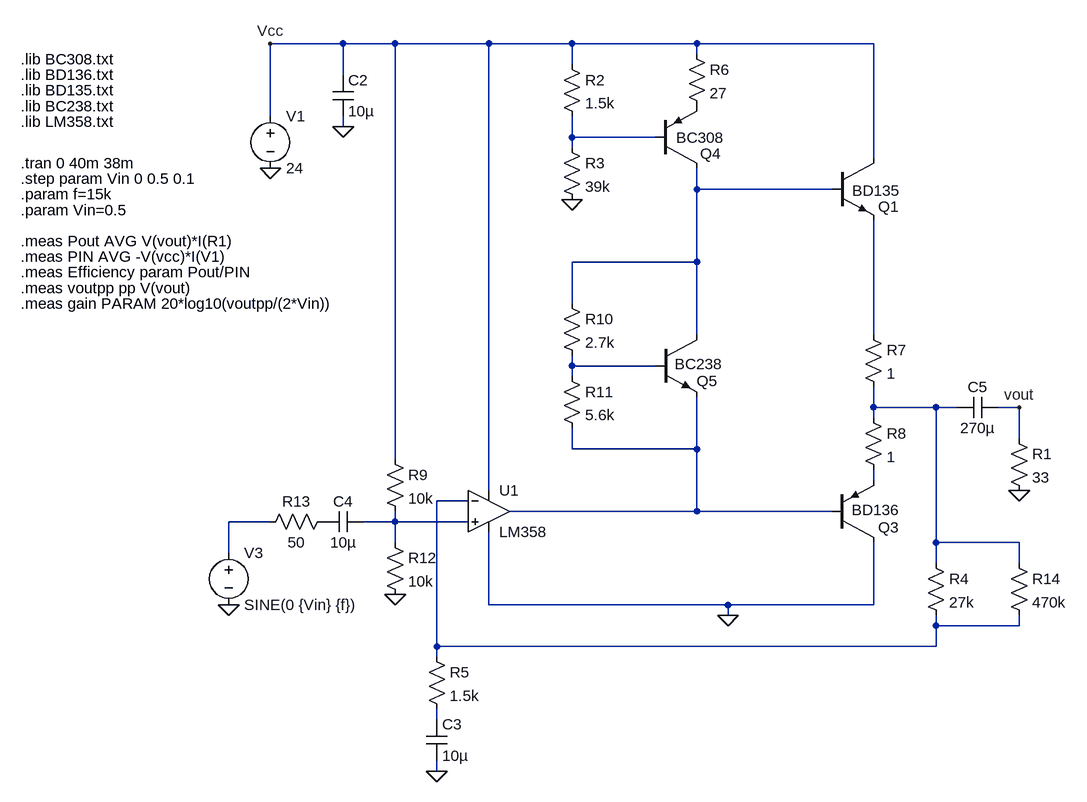
[diagram p0: schematic Draft1.asc]
Draft1.asc, the LTspice schematic file:
Version 4
SHEET 1 1868 680
WIRE 192 -672 80 -672
WIRE 272 -672 192 -672
WIRE 416 -672 272 -672
WIRE 544 -672 416 -672
WIRE 736 -672 544 -672
WIRE 1008 -672 736 -672
WIRE 736 -656 736 -672
WIRE 544 -640 544 -672
WIRE 192 -624 192 -672
WIRE 80 -560 80 -672
WIRE 192 -544 192 -560
WIRE 544 -528 544 -560
WIRE 672 -528 544 -528
WIRE 544 -512 544 -528
WIRE 1008 -496 1008 -672
WIRE 736 -448 736 -480
WIRE 944 -448 736 -448
WIRE 736 -336 736 -448
WIRE 736 -336 544 -336
WIRE 544 -272 544 -336
WIRE 736 -224 736 -336
WIRE 1008 -224 1008 -400
WIRE 544 -176 544 -192
WIRE 672 -176 544 -176
WIRE 544 -160 544 -176
WIRE 1008 -112 1008 -144
WIRE 1104 -112 1008 -112
WIRE 1136 -112 1104 -112
WIRE 1232 -112 1200 -112
WIRE 1008 -96 1008 -112
WIRE 1232 -64 1232 -112
WIRE 544 -48 544 -80
WIRE 736 -48 736 -128
WIRE 736 -48 544 -48
WIRE 272 -32 272 -672
WIRE 1008 0 1008 -16
WIRE 416 16 416 -672
WIRE 384 32 336 32
WIRE 736 48 736 -48
WIRE 736 48 448 48
WIRE 944 48 736 48
WIRE 80 64 16 64
WIRE 272 64 272 48
WIRE 272 64 224 64
WIRE 384 64 272 64
WIRE 272 96 272 64
WIRE 1104 96 1104 -112
WIRE 1232 96 1104 96
WIRE 16 112 16 64
WIRE 1104 128 1104 96
WIRE 1232 128 1232 96
WIRE 416 192 416 80
WIRE 784 192 416 192
WIRE 1008 192 1008 96
WIRE 1008 192 784 192
WIRE 784 208 784 192
WIRE 1104 224 1104 208
WIRE 1232 224 1232 208
WIRE 1232 224 1104 224
WIRE 336 256 336 32
WIRE 1104 256 1104 224
WIRE 1104 256 336 256
WIRE 336 272 336 256
WIRE 336 368 336 352
WIRE 336 448 336 432
FLAG 16 192 0
FLAG 272 176 0
FLAG 336 448 0
FLAG 192 -544 0
FLAG 544 -432 0
FLAG 1232 16 0
FLAG 80 -480 0
FLAG 784 208 0
FLAG 80 -672 Vcc
FLAG 1232 -112 vout
SYMBOL voltage 16 96 R0
WINDOW 123 0 0 Left 0
WINDOW 39 0 0 Left 0
SYMATTR InstName V3
SYMATTR Value SINE(0 {Vin} {f})
SYMBOL res 176 48 R90
WINDOW 0 0 56 VBottom 2
WINDOW 3 32 56 VTop 2
SYMATTR InstName R13
SYMATTR Value 50
SYMBOL cap 224 48 R90
WINDOW 0 0 32 VBottom 2
WINDOW 3 32 32 VTop 2
SYMATTR InstName C4
SYMATTR Value 10µ
SYMBOL res 256 80 R0
SYMATTR InstName R12
SYMATTR Value 10k
SYMBOL res 256 -48 R0
SYMATTR InstName R9
SYMATTR Value 10k
SYMBOL OpAmps\\opamp2 416 -16 R0
SYMATTR InstName U1
SYMATTR Value LM358
SYMBOL res 320 256 R0
SYMATTR InstName R5
SYMATTR Value 1.5k
SYMBOL cap 320 368 R0
SYMATTR InstName C3
SYMATTR Value 10µ
SYMBOL cap 176 -624 R0
SYMATTR InstName C2
SYMATTR Value 10µ
SYMBOL res 528 -656 R0
SYMATTR InstName R2
SYMATTR Value 1.5k
SYMBOL res 528 -528 R0
SYMATTR InstName R3
SYMATTR Value 39k
SYMBOL pnp 672 -480 M180
WINDOW 0 69 23 Left 2
WINDOW 3 32 47 Left 2
SYMATTR InstName Q4
SYMATTR Value BC308
SYMBOL res 720 -672 R0
SYMATTR InstName R6
SYMATTR Value 27
SYMBOL npn 672 -224 R0
WINDOW 0 64 71 Left 2
WINDOW 3 30 45 Left 2
SYMATTR InstName Q5
SYMATTR Value BC238
SYMBOL res 528 -288 R0
SYMATTR InstName R10
SYMATTR Value 2.7k
SYMBOL res 528 -176 R0
SYMATTR InstName R11
SYMATTR Value 5.6k
SYMBOL npn 944 -496 R0
WINDOW 0 71 75 Left 2
WINDOW 3 31 50 Left 2
SYMATTR InstName Q1
SYMATTR Value BD135
SYMBOL pnp 944 96 M180
WINDOW 0 71 23 Left 2
WINDOW 3 30 50 Left 2
SYMATTR InstName Q3
SYMATTR Value BD136
SYMBOL res 992 -240 R0
SYMATTR InstName R7
SYMATTR Value 1
SYMBOL res 992 -112 R0
SYMATTR InstName R8
SYMATTR Value 1
SYMBOL res 1088 112 R0
SYMATTR InstName R4
SYMATTR Value 27k
SYMBOL cap 1200 -128 R90
WINDOW 0 0 32 VBottom 2
WINDOW 3 32 32 VTop 2
SYMATTR InstName C5
SYMATTR Value 270µ
SYMBOL res 1216 -80 R0
SYMATTR InstName R1
SYMATTR Value 33
SYMBOL voltage 80 -576 R0
WINDOW 123 0 0 Left 0
WINDOW 39 0 0 Left 0
SYMATTR InstName V1
SYMATTR Value 24
SYMBOL res 1216 112 R0
SYMATTR InstName R14
SYMATTR Value 470k
TEXT -304 -440 Left 2 !.param f=15k
TEXT -304 -368 Left 2 !.meas Pout AVG V(vout)*I(R1)
TEXT -304 -344 Left 2 !.meas PIN AVG -V(vcc)*I(V1)
TEXT -304 -320 Left 2 !.meas Efficiency param Pout/PIN
TEXT -304 -296 Left 2 !.meas voutpp pp V(vout)
TEXT -304 -272 Left 2 !.meas gain PARAM 20*log10(voutpp/(2*Vin))
TEXT -304 -648 Left 2 !.lib BC308.txt
TEXT -304 -624 Left 2 !.lib BD136.txt
TEXT -304 -600 Left 2 !.lib BD135.txt
TEXT -304 -576 Left 2 !.lib BC238.txt
TEXT -304 -552 Left 2 !.lib LM358.txt
TEXT -304 -488 Left 2 !.tran 0 40m 38m
TEXT -304 -416 Left 2 !.param Vin=0.5
TEXT -304 -464 Left 2 !.step param Vin 0 0.5 0.1

The netlist it stands for:
* Draft1.asc
V3 N009 0 SINE(0 {Vin} {f})
R13 P001 N009 50
C4 N010 P001 10µ
R12 N010 0 10k
R9 Vcc N010 10k
XU1 N010 N008 Vcc 0 N006 LM358  ; pins In+ In- V+ V- OUT
R5 N008 N011 1.5k
C3 N011 0 10µ
C2 Vcc 0 10µ
R2 Vcc N001 1.5k
R3 N001 0 39k
Q4 N002 N001 P002 0 BC308
R6 Vcc P002 27
Q5 N002 N004 N006 0 BC238
R10 N002 N004 2.7k
R11 N004 N006 5.6k
Q1 Vcc N002 N003 0 BD135
Q3 0 N006 N007 0 BD136
R7 N003 N005 1
R8 N005 N007 1
R4 N005 N008 27k
C5 vout N005 270µ
R1 vout 0 33
V1 Vcc 0 24
R14 N005 N008 470k
.model NPN NPN
.model PNP PNP
.lib standard.bjt
.param f=15k
.meas Pout AVG V(vout)*I(R1)
.meas PIN AVG -V(vcc)*I(V1)
.meas Efficiency param Pout/PIN
.meas voutpp pp V(vout)
.meas gain PARAM 20*log10(voutpp/(2*Vin))
.lib BC308.txt
.lib BD136.txt
.lib BD135.txt
.lib BC238.txt
.lib LM358.txt
.tran 0 40m 38m
.param Vin=0.5
.step param Vin 0 0.5 0.1
.backanno
.end